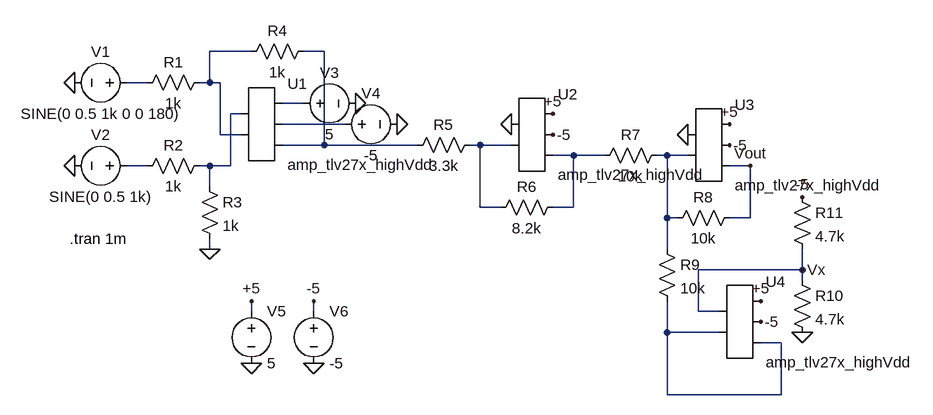
[diagram p0: schematic Lab6_4.asc]
Lab6_4.asc, the LTspice schematic file:
Version 4
SHEET 1 1136 680
WIRE 16 48 -48 48
WIRE 128 48 96 48
WIRE -144 96 -176 96
WIRE -48 96 -48 48
WIRE -48 96 -64 96
WIRE -32 96 -48 96
WIRE 96 128 64 128
WIRE 0 144 -16 144
WIRE 160 160 64 160
WIRE -32 176 -32 96
WIRE 0 176 -32 176
WIRE 128 192 128 48
WIRE 128 192 64 192
WIRE 272 192 128 192
WIRE 368 192 352 192
WIRE 416 192 368 192
WIRE 512 208 480 208
WIRE 560 208 512 208
WIRE 656 208 640 208
WIRE 688 208 656 208
WIRE -144 224 -176 224
WIRE -48 224 -64 224
WIRE -16 224 -16 144
WIRE -16 224 -48 224
WIRE 784 224 752 224
WIRE -48 256 -48 224
WIRE 368 288 368 192
WIRE 400 288 368 288
WIRE 512 288 512 208
WIRE 512 288 480 288
WIRE 656 304 656 208
WIRE 672 304 656 304
WIRE 784 304 784 224
WIRE 784 304 752 304
WIRE -48 352 -48 336
WIRE 656 352 656 304
WIRE 864 384 864 352
WIRE 864 384 704 384
WIRE 864 400 864 384
WIRE 16 448 16 432
WIRE 112 448 112 432
WIRE 704 448 704 384
WIRE 736 448 704 448
WIRE 656 480 656 432
WIRE 736 480 656 480
WIRE 832 496 800 496
WIRE 656 576 656 480
WIRE 832 576 832 496
WIRE 832 576 656 576
FLAG -48 352 0
FLAG 176 128 0
FLAG 240 160 0
FLAG -256 96 0
FLAG -256 224 0
FLAG 112 528 0
FLAG 16 528 0
FLAG 16 432 +5
FLAG 112 432 -5
FLAG 416 160 0
FLAG 480 144 +5
FLAG 480 176 -5
FLAG 752 160 +5
FLAG 752 192 -5
FLAG 688 176 0
FLAG 800 432 +5
FLAG 800 464 -5
FLAG 864 480 0
FLAG 864 272 -5
FLAG 784 224 Vout
FLAG 864 384 Vx
SYMBOL voltage -160 96 R90
WINDOW 0 -32 56 VBottom 2
WINDOW 3 32 56 VTop 2
WINDOW 123 0 0 Left 0
WINDOW 39 0 0 Left 0
SYMATTR InstName V1
SYMATTR Value SINE(0 0.5 1k 0 0 180)
SYMBOL voltage -160 224 R90
WINDOW 0 -32 56 VBottom 2
WINDOW 3 32 56 VTop 2
WINDOW 123 0 0 Left 0
WINDOW 39 0 0 Left 0
SYMATTR InstName V2
SYMATTR Value SINE(0 0.5 1k)
SYMBOL res -48 80 R90
WINDOW 0 0 56 VBottom 2
WINDOW 3 32 56 VTop 2
SYMATTR InstName R1
SYMATTR Value 1k
SYMBOL res -48 208 R90
WINDOW 0 0 56 VBottom 2
WINDOW 3 32 56 VTop 2
SYMATTR InstName R2
SYMATTR Value 1k
SYMBOL res -64 240 R0
SYMATTR InstName R3
SYMATTR Value 1k
SYMBOL res 112 32 R90
WINDOW 0 0 56 VBottom 2
WINDOW 3 32 56 VTop 2
SYMATTR InstName R4
SYMATTR Value 1k
SYMBOL AutoGenerated\\amp_tlv27x_highVdd 32 160 R0
SYMATTR InstName U1
SYMBOL voltage 80 128 R270
WINDOW 0 32 56 VTop 2
WINDOW 3 -32 56 VBottom 2
SYMATTR InstName V3
SYMATTR Value 5
SYMBOL voltage 144 160 R270
WINDOW 0 32 56 VTop 2
WINDOW 3 -32 56 VBottom 2
SYMATTR InstName V4
SYMATTR Value -5
SYMBOL voltage 16 432 R0
SYMATTR InstName V5
SYMATTR Value 5
SYMBOL voltage 112 432 R0
SYMATTR InstName V6
SYMATTR Value -5
SYMBOL res 368 176 R90
WINDOW 0 0 56 VBottom 2
WINDOW 3 32 56 VTop 2
SYMATTR InstName R5
SYMATTR Value 3.3k
SYMBOL AutoGenerated\\amp_tlv27x_highVdd 448 176 R0
SYMATTR InstName U2
SYMBOL res 496 272 R90
WINDOW 0 0 56 VBottom 2
WINDOW 3 32 56 VTop 2
SYMATTR InstName R6
SYMATTR Value 8.2k
SYMBOL res 656 192 R90
WINDOW 0 0 56 VBottom 2
WINDOW 3 32 56 VTop 2
SYMATTR InstName R7
SYMATTR Value 10k
SYMBOL AutoGenerated\\amp_tlv27x_highVdd 720 192 R0
SYMATTR InstName U3
SYMBOL res 768 288 R90
WINDOW 0 0 56 VBottom 2
WINDOW 3 32 56 VTop 2
SYMATTR InstName R8
SYMATTR Value 10k
SYMBOL res 640 336 R0
SYMATTR InstName R9
SYMATTR Value 10k
SYMBOL AutoGenerated\\amp_tlv27x_highVdd 768 464 R0
SYMATTR InstName U4
SYMBOL res 848 384 R0
SYMATTR InstName R10
SYMATTR Value 4.7k
SYMBOL res 848 256 R0
SYMATTR InstName R11
SYMATTR Value 4.7k
TEXT -264 336 Left 2 !.tran 1m

The netlist it stands for:
* Lab6_4.asc
V1 N003 0 SINE(0 0.5 1k 0 0 180)
V2 N010 0 SINE(0 0.5 1k)
R1 N001 N003 1k
R2 N005 N010 1k
R3 N005 0 1k
R4 N002 N001 1k
* U1: amp_tlv27x_highVdd (symbol AutoGenerated\amp_tlv27x_highVdd not available, pins judged from their places): pin1=N005 pin2=N001 pin3=N004 pin4=N006 pin5=N002
V3 N004 0 5
V4 N006 0 -5
V5 +5 0 5
V6 -5 0 -5
R5 N007 N002 3.3k
* U2: amp_tlv27x_highVdd (symbol AutoGenerated\amp_tlv27x_highVdd not available, pins judged from their places): pin1=0 pin2=N007 pin3=+5 pin4=-5 pin5=N008
R6 N008 N007 8.2k
R7 N009 N008 10k
* U3: amp_tlv27x_highVdd (symbol AutoGenerated\amp_tlv27x_highVdd not available, pins judged from their places): pin1=0 pin2=N009 pin3=+5 pin4=-5 pin5=Vout
R8 Vout N009 10k
R9 N009 N011 10k
* U4: amp_tlv27x_highVdd (symbol AutoGenerated\amp_tlv27x_highVdd not available, pins judged from their places): pin1=Vx pin2=N011 pin3=+5 pin4=-5 pin5=N011
R10 Vx 0 4.7k
R11 -5 Vx 4.7k
.tran 1m
.backanno
.end